# Altium schematic sheet Sensors.SchDoc
size A4; SheetNumber: 1; SheetTotal: 2
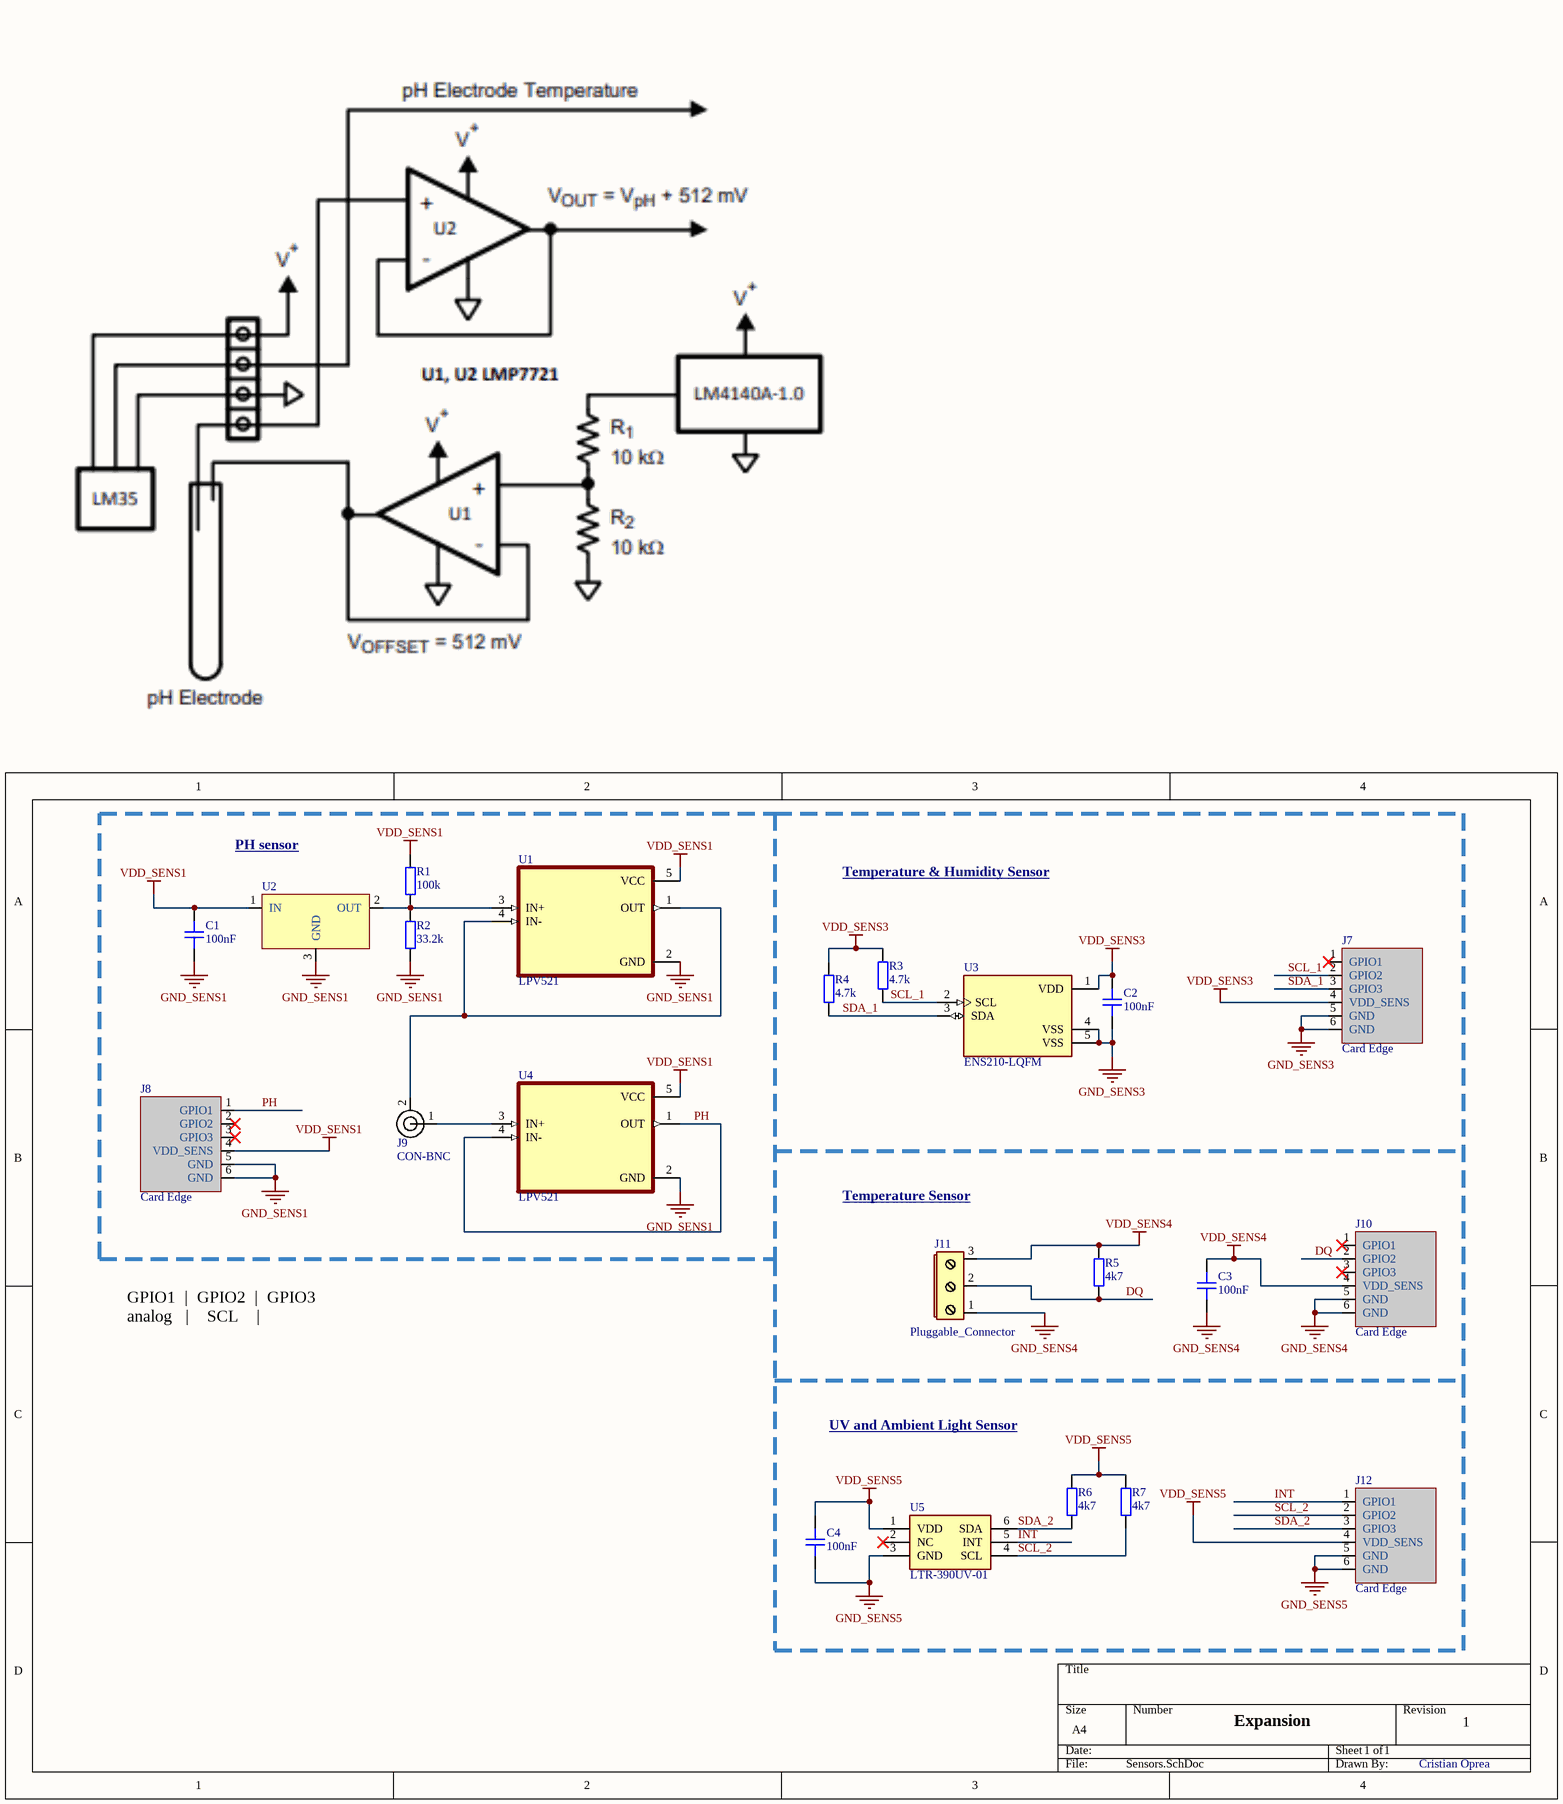
[diagram p0: Sensors.SchDoc]

## Parts
C1  100nF  [C0603]
C2  100nF  [C0603]
C3  100nF  [C0603]
C4  100nF  [C0603]
J7  Card Edge  [Card Edge]
J8  Card Edge  [Card Edge]
J9  CON-BNC  [CON_BNC_MOLEX_0731375003]
J10  Card Edge  [Card Edge]
J11  Pluggable_Connector  [5mm_screw_terminal_3_pos]
J12  Card Edge  [Card Edge]
R1  100k  [R0603]
R2  33.2k  [R0603]
R3  4.7k  [R0603]
R4  4.7k  [R0603]
R5  4k7  [R0603]
R6  4k7  [R0603]
R7  4k7  [R0603]
U1  LPV521  [SOT65P210X110-5N]
U2  ADR5040BKSZ-REEL7  [SOT23-3]  (value not drawn)
U3  ENS210-LQFM  [XDCR_ENS210-LQFM]
U4  LPV521  [SOT65P210X110-5N]
U5  LTR-390UV-01  [LTR390-UV]

## Nets
GND_SENS1: C1.1 J8.5(GND) J8.6(GND) R2.1 U1.2(GND) U2.3(GND) U4.2(GND)
GND_SENS3: C2.1 J7.5(GND) J7.6(GND) U3.4(VSS) U3.5(VSS)
GND_SENS4: C3.1 J10.5(GND) J10.6(GND) J11.1
GND_SENS5: C4.1 J12.5(GND) J12.6(GND) U5.3(GND)
VDD_SENS1: C1.2 J8.4(VDD_SENS) R1.2 U1.5(VCC) U2.1(IN) U4.5(VCC)
VDD_SENS3: C2.2 J7.4(VDD_SENS) R3.2 R4.1 U3.1(VDD)
VDD_SENS4: C3.2 J10.4(VDD_SENS) J11.3 R5.2
VDD_SENS5: C4.2 J12.4(VDD_SENS) R6.2 R7.2 U5.1(VDD)
DQ: J10.2(GPIO2) J11.2 R5.1
INT: J12.1(GPIO1) U5.5(INT)
PH: J8.1(GPIO1) U4.1(OUT) U4.4(IN-)
SCL_1: J7.2(GPIO2) R3.1 U3.2(SCL)
SCL_2: J12.2(GPIO2) R7.1 U5.4(SCL)
SDA_1: J7.3(GPIO3) R4.2 U3.3(SDA)
SDA_2: J12.3(GPIO3) R6.1 U5.6(SDA)
NetJ9_1: J9.1 U4.3(IN+)
NetJ9_2: J9.2 U1.1(OUT) U1.4(IN-)
NetR1_1: R1.1 R2.2 U1.3(IN+) U2.2(OUT)

Not connected (* = marked no-connect by the designer): J7 1(GPIO1)*; J8 2(GPIO2)* 3(GPIO3)*; J10 1(GPIO1)* 3(GPIO3)*; U5 2(NC)*

## Notes on the sheet
- PH sensor
- Temperature & Humidity Sensor
- Temperature Sensor
- GPIO1  |  GPIO2  |  GPIO3    analog   |    SCL    |     SDA
- UV and Ambient Light Sensor
- Expansion
- 1
- Cristian Oprea

## Library data of the parts
C1-C4 = CAP_0603: Capacitor SMD 0603; Manufacturer: *; Manufacturer Part Number: *; Distributor Link: *; LCSC: *; Rating: *; Dielectric: *
J7 J8 J10 J12 = Card Edge: Card Edge pads for 2.54 mm pitch edge connector
J9 = CON-BNC: RF Connector BNC Female 50 Ohms PCB TH Mount; Manufacturer: RF Solutions; Manufacturer Part Number: CON-SMA-EDGE-S
J11 = Pluggable_Connector: Screw terminal or plug terminal
R1-R4 = RES_0603: Resistor SMD 0603; Manufacturer: *; Manufacturer Part Number: *; Distributor Link: *; LCSC: *
R5-R7 = RES_0805: Resistor SMD 0805; Manufacturer: *; Manufacturer Part Number: *; Distributor Link: *; LCSC: *
U1 U4 = LPV521: MP: MAX4466EXK; Package: None; Price: None; Value: *; Availability: Unavailable
U2 = VREF: Voltage References 2.048 Low-Cost, Micropower, Low-Dropout, High-Output-Current, SOT23; Manufacturer: Maxim Integrated; Manufacturer Part Number: MAX6101EUR+T
U3 = ENS210-LQFM: Humidity/Temperature Sensor Digital Serial (2-Wire, I2C) 4-Pin QFN EP T/R; MF: ScioSense; SnapEDA_Link: https://www.snapeda.com/parts/ENS210-LQFM/ScioSense/view-part/?ref=snap; Package: NON STANDARD-5 ScioSense; Value: *; MP: ENS210-LQFM; Check_prices: https://www.snapeda.com/parts/ENS210-LQFM/ScioSense/view-part/?ref=eda
U5 = LTR-390UV-01: SENSOR OPT ULTRAVIOLET 6PINS; Manufacturer_Name: Lite-On; Geometry.Height: 0.9mm; Manufacturer_Part_Number: LTR-390UV-01; Mouser Part Number: 859-LTR390UV01; Mouser Price/Stock: https://www.mouser.co.uk/ProductDetail/Lite-On/LTR-390UV-01?qs=g5ciJ0jwZaECcUd5i6p7%252Bg%3D%3D; Arrow Part Number: LTR-390UV-01; Arrow Price/Stock: https://www.arrow.com/en/products/ltr-390uv-01/lite-on-technology?region=nac; Datasheet Link: https://www.arrow.com/en/products/ltr-390uv-01/lite-on-technology